# Altium schematic sheet MCU.SchDoc
size A3
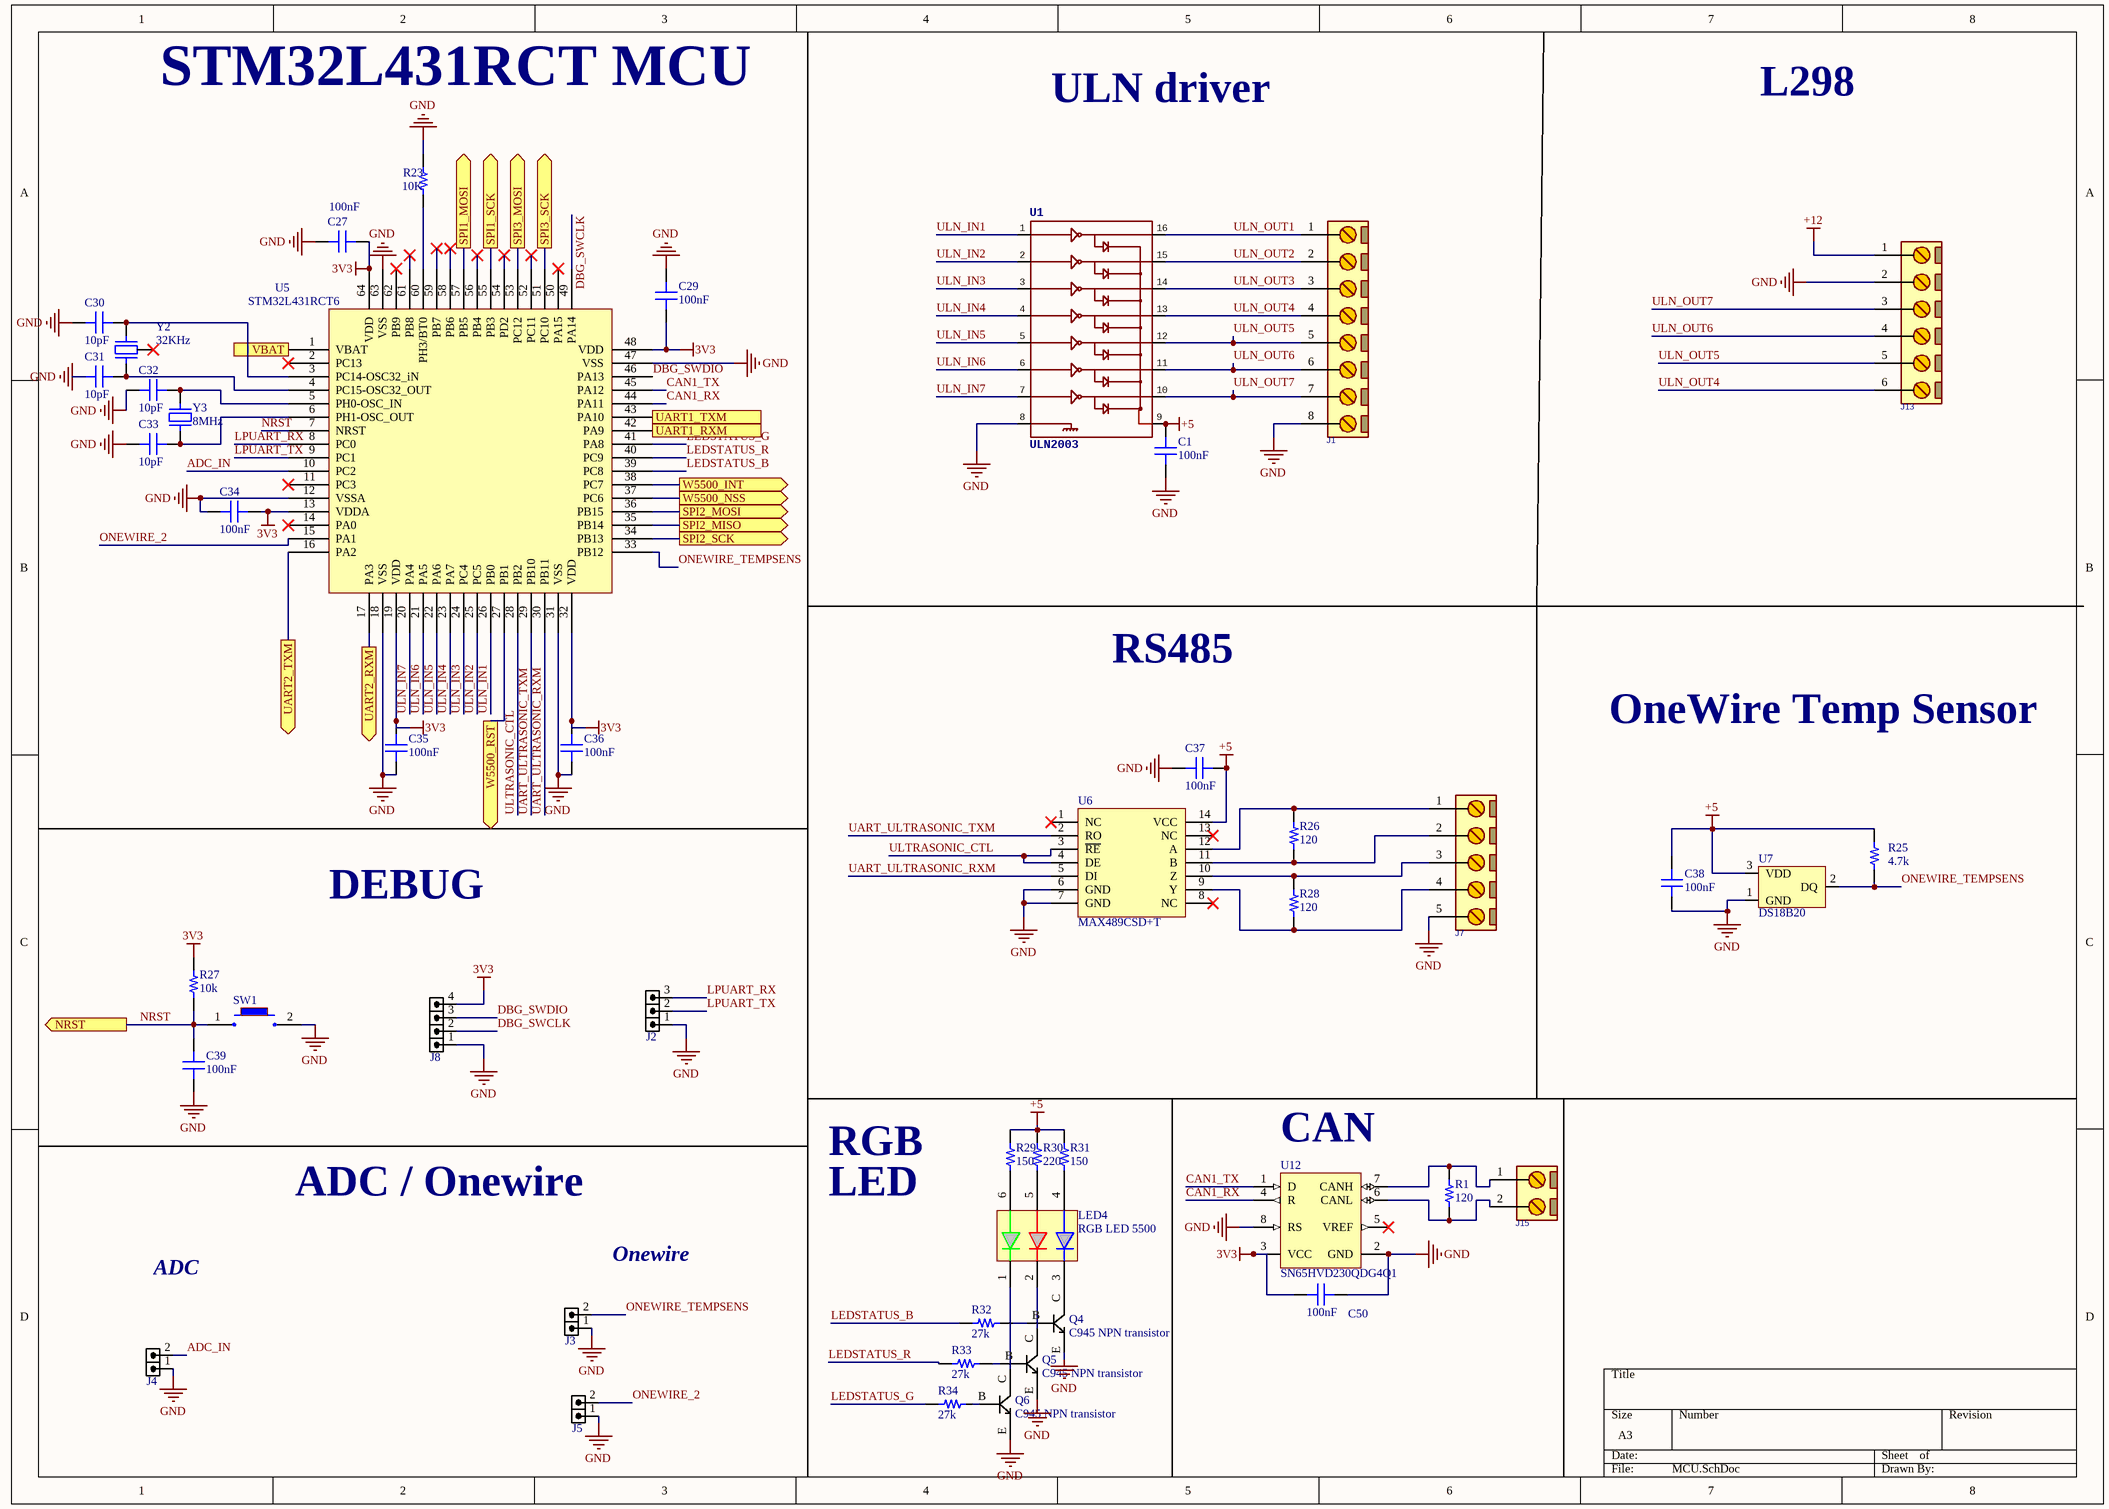
[diagram p0: MCU.SchDoc]

## Parts
C1  100nF  [CAP 0805_2012]
C27  100nF  [CAP 0805_2012]
C29  100nF  [CAP 0805_2012]
C30  10pF  [CAP 0805_2012]
C31  10pF  [CAP 0805_2012]
C32  10pF  [CAP 0805_2012]
C33  10pF  [CAP 0805_2012]
C34  100nF  [CAP 0805_2012]
C35  100nF  [CAP 0805_2012]
C36  100nF  [CAP 0805_2012]
C37  100nF  [CAP 0805_2012]
C38  100nF  [CAP 0805_2012]
C39  100nF  [CAP 0805_2012]
C50  100nF  [CAP 0805_2012]
J1  Phoenix MSTBV 8Pin  [PHOENIX MSTBV_8]  (value not drawn)
J2  HDRM3  [HDR_M_1X3]  (value not drawn)
J3  HDRM2  [HDR_M_1X2]  (value not drawn)
J4  HDRM2  [HDR_M_1X2]  (value not drawn)
J5  HDRM2  [HDR_M_1X2]  (value not drawn)
J7  Phoenix MSTBV 5Pin  [PHOENIX MSTBV_5]  (value not drawn)
J8  HDR1X4  [HDR_M_1X4]  (value not drawn)
J13  Phoenix MKDS 6Pin  [TBG_6]  (value not drawn)
J15  Phoenix MSTBV 2Pin  [PHOENIX MSTBV_2]  (value not drawn)
LED4  RGB LED 5500  [LED5500]
Q4  C945 NPN transistor  [SO-23]
Q5  C945 NPN transistor  [SO-23]
Q6  C945 NPN transistor  [SO-23]
R1  120  [RES 0805_2012]
R23  10K  [RES 0805_2012]
R25  4.7k  [RES 0805_2012]
R26  120  [RES 0805_2012]
R27  10k  [RES 0805_2012]
R28  120  [RES 0805_2012]
R29  150  [RES 0805_2012]
R30  220  [RES 0805_2012]
R31  150  [RES 0805_2012]
R32  27k  [RES 0805_2012]
R33  27k  [RES 0805_2012]
R34  27k  [RES 0805_2012]
SW1  Rec. Button  [REC_PUSHBUTTON_FTPRNT]  (value not drawn)
U1  ULN2003  [SOIC-16 9.9X3.9MM P1.27MM]
U5  STM32L431RCT6  [LQFP64]
U6  MAX489CSD+T  [SOIC-14]
U7  DS18B20  [TO-92A]
U12  SN65HVD230QDG4Q1  [D8_L]
Y2  32KHz  [C-002R TH]
Y3  8MHz  [HC-49S SMD]

## Ports
NRST (out), SPI1_MOSI (out), SPI1_SCK (out), SPI2_MISO (out), SPI2_MOSI (out), SPI2_SCK (out), SPI3_MOSI (out), SPI3_SCK (out), UART1_RXM (out), UART1_TXM (out), UART2_RXM (out), UART2_TXM (out), VBAT (in), W5500_INT (out), W5500_NSS (out), W5500_RST (out)

## Nets
3V3: C27.1 C29.1 C34.2 C35.2 C36.2 C50.2 J8.4 R27.2 U5.13(VDDA) U5.19(VDD) U5.32(VDD) U5.48(VDD) U5.64(VDD) U12.3(VCC)
+5: C1.2 C37.2 C38.2 R25.1 R29.2 R30.2 R31.2 U1.9 U6.14(VCC) U7.3(VDD)
+12: J13.1
GND: C1.1 C27.2 C29.2 C30.1 C31.1 C32.1 C33.1 C34.1 C35.1 C36.1 C37.1 C38.1 C39.1 C50.1 J1.8 J2.1 J3.1 J4.1 J5.1 J7.5 J8.1 J13.2 Q4.E Q5.E Q6.E R23.1 SW1.2 U1.8 U5.12(VSSA) U5.18(VSS) U5.31(VSS) U5.47(VSS) U5.63(VSS) U6.6(GND) U6.7(GND) U7.1(GND) U12.2(GND) U12.8(RS)
ADC_IN: J4.2 U5.10(PC2)
CAN1_RX: U5.44(PA11) U12.4(R)
CAN1_TX: U5.45(PA12) U12.1(D)
DBG_SWCLK: J8.2 U5.49(PA14)
DBG_SWDIO: J8.3 U5.46(PA13)
LEDSTATUS_B: R32.1 U5.39(PC8)
LEDSTATUS_G: R34.1 U5.41(PA8)
LEDSTATUS_R: R33.1 U5.40(PC9)
LPUART_RX: J2.3 U5.8(PC0)
LPUART_TX: J2.2 U5.9(PC1)
NRST: C39.2 R27.1 SW1.1 U5.7(NRST) ; port NRST
ONEWIRE_2: J5.2 U5.15(PA1)
ONEWIRE_TEMPSENS: J3.2 R25.2 U5.33(PB12) U7.2(DQ)
SPI1_MOSI: U5.57(PB5) ; port SPI1_MOSI
SPI1_SCK: U5.55(PB3) ; port SPI1_SCK
SPI2_MISO: U5.35(PB14) ; port SPI2_MISO
SPI2_MOSI: U5.36(PB15) ; port SPI2_MOSI
SPI2_SCK: U5.34(PB13) ; port SPI2_SCK
SPI3_MOSI: U5.53(PC12) ; port SPI3_MOSI
SPI3_SCK: U5.51(PC10) ; port SPI3_SCK
UART1_RXM: U5.42(PA9) ; port UART1_RXM
UART1_TXM: U5.43(PA10) ; port UART1_TXM
UART2_RXM: U5.17(PA3) ; port UART2_RXM
UART2_TXM: U5.16(PA2) ; port UART2_TXM
UART_ULTRASONIC_RXM: U5.30(PB11) U6.5(DI)
UART_ULTRASONIC_TXM: U5.29(PB10) U6.2(RO)
ULN_IN1: U1.1 U5.26(PB0)
ULN_IN2: U1.2 U5.25(PC5)
ULN_IN3: U1.3 U5.24(PC4)
ULN_IN4: U1.4 U5.23(PA7)
ULN_IN5: U1.5 U5.22(PA6)
ULN_IN6: U1.6 U5.21(PA5)
ULN_IN7: U1.7 U5.20(PA4)
ULN_OUT1: J1.1 U1.16
ULN_OUT2: J1.2 U1.15
ULN_OUT3: J1.3 U1.14
ULN_OUT4: J1.4 J13.6 U1.13
ULN_OUT5: J1.5 J13.5 U1.12
ULN_OUT6: J1.6 J13.4 U1.11
ULN_OUT7: J1.7 J13.3 U1.10
ULTRASONIC_CTL: U5.28(PB2) U6.3(~{RE}) U6.4(DE)
VBAT: U5.1(VBAT) ; port VBAT
W5500_INT: U5.38(PC7) ; port W5500_INT
W5500_NSS: U5.37(PC6) ; port W5500_NSS
W5500_RST: U5.27(PB1) ; port W5500_RST
NetC30_2: C30.2 U5.3(PC14-OSC32_iN) Y2.2
NetC31_2: C31.2 U5.4(PC15-OSC32_OUT) Y2.1
NetC32_2: C32.2 U5.5(PH0-OSC_IN) Y3.2
NetC33_2: C33.2 U5.6(PH1-OSC_OUT) Y3.1
NetJ7_1: J7.1 R26.2 U6.12(A)
NetJ7_2: J7.2 R26.1 U6.11(B)
NetJ7_3: J7.3 R28.2 U6.10(Z)
NetJ7_4: J7.4 R28.1 U6.9(Y)
NetJ15_1: J15.1 R1.2 U12.7(CANH)
NetJ15_2: J15.2 R1.1 U12.6(CANL)
NetLED4_1: LED4.1 Q6.C
NetLED4_2: LED4.2 Q5.C
NetLED4_3: LED4.3 Q4.C
NetLED4_4: LED4.4 R31.1
NetLED4_5: LED4.5 R30.1
NetLED4_6: LED4.6 R29.1
NetQ4_B: Q4.B R32.2
NetQ5_B: Q5.B R33.2
NetQ6_B: Q6.B R34.2
NetR23_2: R23.2 U5.60(PH3/BT0)

Not connected (* = marked no-connect by the designer): U5 2(PC13)* 11(PC3)* 14(PA0)* 50(PA15)* 52(PC11)* 54(PD2)* 56(PB4)* 58(PB6)* 59(PB7)* 61(PB8)* 62(PB9)*; U6 1(NC)* 8(NC)* 13(NC)*; U12 5(VREF)*; Y2 3(GND)*

## Notes on the sheet
- STM32L431RCT MCU
- ULN driver
- L298
- RS485
- OneWire Temp Sensor
- DEBUG
- RGB
- (near U12) CAN
- ADC / Onewire
- Onewire
- LED
- ADC

## Library data of the parts
C1 C27 C29 C34-C39 C50 = Cap 0805: SMT Capacitor; VALUE: 100nF
C30-C33 = Cap 0805: SMT Capacitor; VALUE: 100nF
J1 = Phoenix MSTBV 8Pin: CONN, PHOENIX MSTBV, 5-G, 5.08mm pitch; PartNumber: MSTBV 2,5/ 8-G-5,08 1758076
J2 = HDR_M_1X3: CONN, HEADER, Male, pitch: 2.54mm, 3POS; VALUE: HDRM3
J3-J5 = HDR_M_1X2: CONN, HEADER, Male, pitch: 2.54mm, 2POS; VALUE: HDRM2
J7 = Phoenix MSTBV 5Pin: CONN, PHOENIX MSTBV, 5-G, 5.08mm pitch; PartNumber: MSTBV 2,5/ 5-G-5,08 1758047
J8 = HDR_M_1X4: CONN, HEADER, Male, pitch: 2.54mm, 4POS; VALUE: HDRM4
J13 = Phoenix MKDS 6Pin: CONN, PHOENIX MKDS, 5.08mm pitch; PartNumber: MKDS 1,5/ 6-5,08 - 1710726
J15 = Phoenix MSTBV 2Pin: CONN, PHOENIX MSTBV, 5-G, 5.08mm pitch; PartNumber: MSTBV 2,5/ 2-G-5,08 - 1758018
LED4 = LED RGB 5500 Common Anode
Q4-Q6 = C945: C945 NPN transistor hfE = 140~400
R1 R23 R25-R34 = Res 0805: SMT Resistor; VALUE: 1K
SW1 = Rectangle_PushButton
U1 = ULN2003 (SMD): Bipolar (BJT) Transistor Array 7 NPN Darlington 50V 500mA   Surface Mount 16-SO; PartNumber: ULN2003D1013TR
U5 = STM32L431RCT6: IC MCU 32BIT 256KB FLASH 64LQFP; Manufacturer: STMicroelectronics; Interface: I2C,SPI,IrDA,MMC,SD,UART,USART; Peripherals: Brown-out Detect/Reset,PWM,WDT,DMA; Core Architecture: ARM; Frequency: 80MHz; Number of I/Os: 52; Oscillator Type: Internal; Supplier 1: Digi-Key; Manufacturer Part Number: STM32L431RCT6; RoHS: Yes; Category: Microcontrollers; Case/Package: LQFP; Number of Pins: 64; Min Operating Temperature: -40°C; Max Operating Temperature: 85°C; Memory Type: FLASH; Packaging: Tray; Memory Size: 256KB; RoHS Compliant: Yes; ComponentLink1URL: https://4donline.ihs.com/images/VipMasterIC/IC/SGST/SGST-S-A0003208311/SGST-S-A0003208311-1.pdf?hkey=52A5661711E402568146F3353EA87419&src-supplier=Farnell; ComponentLink1Description: https://4donline.ihs.com/images/VipMasterIC/IC/SGST/SGST-S-A0003208311/SGST-S-A0003208311-1.pdf?hkey=52A5661711E402568146F3353EA87419&src-supplier=Farnell; ComponentLink2URL: http://www.st.com/content/ccc/resource/technical/document/reference_manual/group0/b0/ac/3e/8f/6d/21/47/af/DM00151940/files/DM00151940.pdf/jcr:content/translations/en.DM00151940.pdf?src-supplier=Digi-Key; ComponentLink2Description: http://www.st.com/content/ccc/resource/technical/document/reference_manual/group0/b0/ac/3e/8f/6d/21/47/af/DM00151940/files/DM00151940.pdf/jcr:content/translations/en.DM00151940.pdf?src-supplier=Digi-Key; ComponentLink3URL: https://4donline.ihs.com/images/VipMasterIC/IC/SGST/SGST-S-A0003208311/SGST-S-A0003208311-1.pdf?hkey=52A5661711E402568146F3353EA87419&src-supplier=Newark; ComponentLink3Description: https://4donline.ihs.com/images/VipMasterIC/IC/SGST/SGST-S-A0003208311/SGST-S-A0003208311-1.pdf?hkey=52A5661711E402568146F3353EA87419&src-supplier=Newark; Supplier Part Number 1: 497-17960-ND
U6 = MAX489CSD+T: MAX489 Series 0.25 Mbps 12V Full Duplex SMT RS 485 Transceiver - SOIC-14; Manufacturer: Maxim; Number of Receivers: 1; Operating Supply Voltage: 5V; Nominal Supply Current: 250uA; Data Rate: 250Kbps; Logic Function: Transceiver,Receiver; Interface: RS-422,RS-485; Min Supply Voltage: 4.75V; Max Supply Voltage: 5.25V; Receiver Hysteresis: 70mV; Supplier 1: Digi-Key; Manufacturer Part Number: MAX489CSD+T; RoHS: Yes; Category: Buffers, Drivers and Transceivers; Mount: Surface Mount; Case/Package: SOIC; Number of Pins: 14; Contact Plating: Tin,Matte; Min Operating Temperature: 0°C; Max Operating Temperature: 70°C; Number of Transmitters: 1; Packaging: Tape and Reel; Package Quantity: 2500; Number of Drivers: 1; Number of Transceivers: 1; Simplex/Duplex: Full Duplex; Series: -; Supply Current: 250uA; Radiation Hardening: No; Reach SVHC Compliant: Unknown; Lead Free: Lead Free; RoHS Compliant: Yes; ComponentLink1URL: https://datasheet.ciiva.com/1774/max1487-max491-1774522.pdf?src-supplier=Digi-Key; ComponentLink1Description: https://datasheet.ciiva.com/1774/max1487-max491-1774522.pdf?src-supplier=Digi-Key; ComponentLink2URL: https://datasheet.ciiva.com/12260/max1487-max491-96074-12260682.pdf?src-supplier=Mouser; ComponentLink2Description: https://datasheet.ciiva.com/12260/max1487-max491-96074-12260682.pdf?src-supplier=Mouser; Supplier Part Number 1: MAX489CSD+CT-ND
U7 = DS18B20 (THD): Temperature Sensor Digital, Local -55°C ~ 125°C 12 b TO-92-3; PartNumber: DS18B20+T&R
U12 = SN65HVD230QDG4Q1: Automotive Catalog 3.3 V CAN Transceiver, 17 mA, -40 to 125 degC, 8-pin SOIC (D), Green (RoHS & no Sb/Br); Manufacturer: Texas Instruments; Drivers Per Package: 1; Transient Pulse Protection(V): -25 to 25; ICC(Max)(mA): 17; Supply Voltage(s)(V): 3.3; DatasheetVersion: SGLS398A; PackageVersion: revM, Jun-2011; PackageReference: D8; PackageDescription: 8-Pin Plastic Small Outline Integrated Circuit, 4.9 x 3.9 mm, Pitch 1.27 mm Pitch; Supplier 1: Digi-Key; Supplier Part Number 1: 296-23353-5-ND; Supplier 2: Digi-Key; Supplier Part Number 2: 296-23353-2-ND; Supplier 3: Digi-Key; Supplier Part Number 3: 296-23353-6-ND; Supplier 4: Newark; Supplier Part Number 4: 54M7270; Supplier 5: Mouser; Supplier Part Number 5: 595-SN65HVD230QDG4Q1; Eco-Plan: Green (RoHS & no Sb/Br); SubFamily: CAN; Receivers Per Package: 1; Isolated: No; Footprint: PCA82C250; Rating: Automotive; Mounting Technology: Surface Mount; PartNumber: SN65HVD230QDG4Q1; Code_JEDEC: MS-012AA; ComponentLink1Description: Datasheet; ComponentLink1URL: http://www.ti.com/general/docs/lit/getliterature.tsp?genericPartNumber=SN65HVD230Q-Q1&fileType=pdf
Y2 = Crystal C-002R THD: SMT Crystal; VALUE: 32KHz
Y3 = Crystal HC-49S SMD 8MHz: SMT Crystal; PartNumber: ABLS-8.000MHZ-K4T